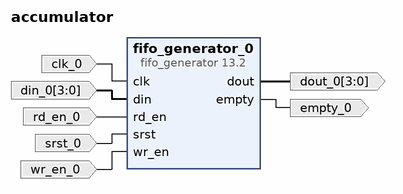
[diagram p0: block diagram of the top level]
# Vivado block design accumulator, xc7a35tcpg236-1, Vivado 2022.2
create_bd_design accumulator

create_bd_port -dir I rd_en_0
create_bd_port -dir I srst_0
create_bd_port -dir I -from 3 -to 0 din_0
create_bd_port -dir I wr_en_0
create_bd_port -dir O -from 3 -to 0 dout_0
create_bd_port -dir O empty_0
create_bd_port -dir I -type clk clk_0
set_property -dict {CONFIG.FREQ_HZ 25000000} [get_bd_ports clk_0]

create_bd_cell -type ip -vlnv xilinx.com:ip:fifo_generator:13.2 fifo_generator_0
set_property -dict {CONFIG.Input_Data_Width 4 CONFIG.Input_Depth 4096} [get_bd_cells fifo_generator_0]

# ---- connections ----

connect_bd_net -net clk_0_1 [get_bd_ports clk_0] [get_bd_pins fifo_generator_0/clk]
connect_bd_net -net din_0_1 [get_bd_ports din_0] [get_bd_pins fifo_generator_0/din]
connect_bd_net [get_bd_pins fifo_generator_0/dout] [get_bd_ports dout_0]
connect_bd_net [get_bd_pins fifo_generator_0/empty] [get_bd_ports empty_0]
connect_bd_net -net rd_en_0_1 [get_bd_ports rd_en_0] [get_bd_pins fifo_generator_0/rd_en]
connect_bd_net -net srst_0_1 [get_bd_ports srst_0] [get_bd_pins fifo_generator_0/srst]
connect_bd_net -net wr_en_0_1 [get_bd_ports wr_en_0] [get_bd_pins fifo_generator_0/wr_en]

validate_bd_design
save_bd_design
